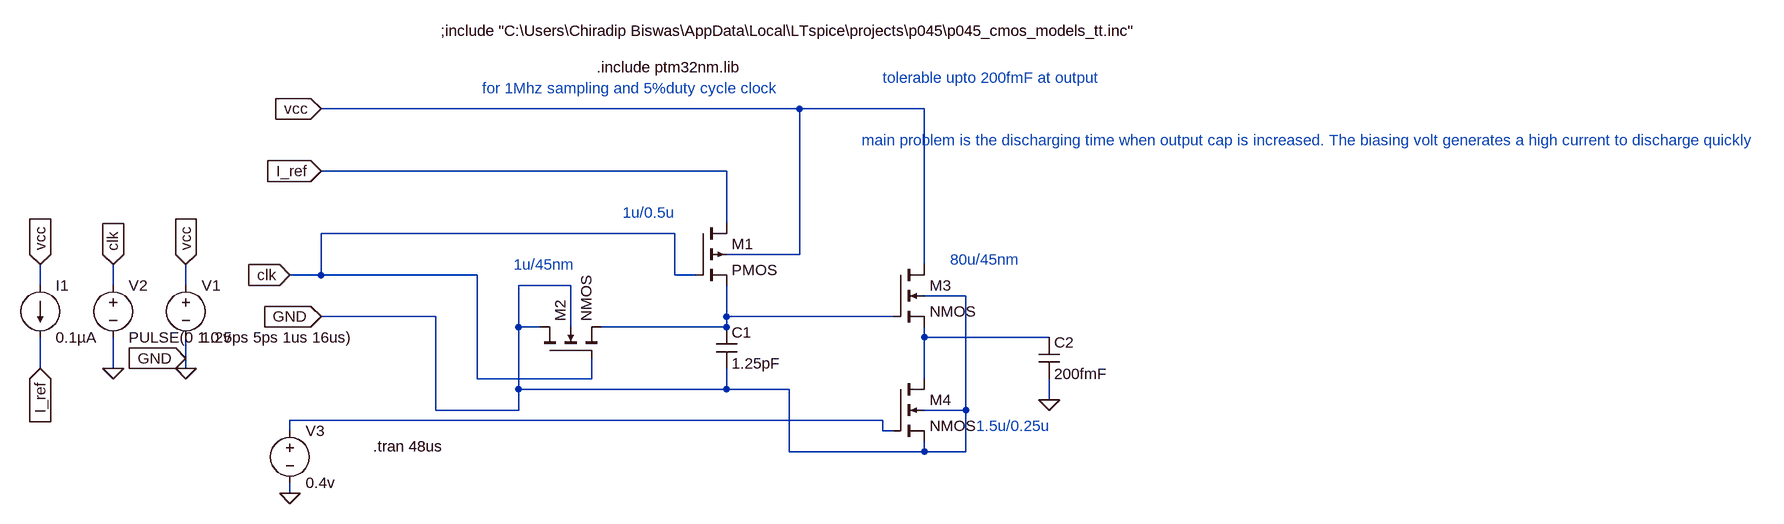
[diagram p0: schematic ramping_ckt_trials.asc]
ramping_ckt_trials.asc, the LTspice schematic file:
Version 4
SHEET 1 2788 924
WIRE 864 96 128 96
WIRE 1056 96 864 96
WIRE 752 192 128 192
WIRE 752 272 752 192
WIRE 672 288 128 288
WIRE 864 320 864 96
WIRE 864 320 752 320
WIRE 1056 336 1056 96
WIRE 128 352 128 288
WIRE 128 352 80 352
WIRE 368 352 128 352
WIRE 672 352 672 288
WIRE 704 352 672 352
WIRE -304 368 -304 336
WIRE -192 368 -192 336
WIRE -80 368 -80 336
WIRE 512 368 432 368
WIRE 1120 384 1056 384
WIRE 304 416 128 416
WIRE 752 416 752 368
WIRE 1008 416 752 416
WIRE 432 432 432 368
WIRE 464 432 432 432
WIRE 512 432 512 368
WIRE 752 432 752 416
WIRE 752 432 560 432
WIRE 1056 448 1056 432
WIRE 1248 448 1056 448
WIRE -80 480 -80 448
WIRE -304 496 -304 448
WIRE -192 496 -192 448
WIRE -80 496 -80 480
WIRE 368 512 368 352
WIRE 544 512 544 480
WIRE 544 512 368 512
WIRE 1056 512 1056 448
WIRE 432 528 432 432
WIRE 752 528 752 496
WIRE 752 528 432 528
WIRE 848 528 752 528
WIRE 1248 544 1248 512
WIRE 304 560 304 416
WIRE 432 560 432 528
WIRE 432 560 304 560
WIRE 1120 560 1120 384
WIRE 1120 560 1056 560
WIRE 992 576 80 576
WIRE 80 592 80 576
WIRE 992 592 992 576
WIRE 1008 592 992 592
WIRE 848 624 848 528
WIRE 1056 624 1056 608
WIRE 1056 624 848 624
WIRE 1120 624 1120 560
WIRE 1120 624 1056 624
WIRE 80 688 80 672
FLAG 128 192 I_ref
IOPIN 128 192 In
FLAG 80 352 clk
IOPIN 80 352 In
FLAG 128 96 vcc
IOPIN 128 96 In
FLAG 128 416 GND
IOPIN 128 416 In
FLAG -80 496 0
FLAG -192 496 0
FLAG -80 336 vcc
IOPIN -80 336 In
FLAG -192 336 clk
IOPIN -192 336 In
FLAG -304 336 vcc
IOPIN -304 336 In
FLAG -304 496 I_ref
IOPIN -304 496 In
FLAG -80 480 GND
IOPIN -80 480 In
FLAG 80 688 0
FLAG 1248 544 0
SYMBOL pmos4 704 272 R0
SYMATTR InstName M1
SYMATTR Value2 l=0.5u w=1u
SYMBOL nmos4 464 480 R270
SYMATTR InstName M2
SYMATTR Value2 l=45nm w=1u
SYMBOL cap 736 432 R0
SYMATTR InstName C1
SYMATTR Value 1.25pF
SYMBOL voltage -80 352 R0
WINDOW 123 0 0 Left 0
WINDOW 39 0 0 Left 0
SYMATTR InstName V1
SYMATTR Value 1.2v
SYMBOL voltage -192 352 R0
WINDOW 123 0 0 Left 0
WINDOW 39 0 0 Left 0
SYMATTR InstName V2
SYMATTR Value PULSE(0 1 0 5ps 5ps 1us 16us)
SYMBOL current -304 368 R0
WINDOW 123 0 0 Left 0
WINDOW 39 0 0 Left 0
SYMATTR InstName I1
SYMATTR Value 0.1µA
SYMBOL voltage 80 576 R0
WINDOW 123 0 0 Left 0
WINDOW 39 0 0 Left 0
SYMATTR InstName V3
SYMATTR Value 0.4v
SYMBOL nmos4 1008 336 R0
SYMATTR InstName M3
SYMATTR Value2 l=45nm w=80u
SYMBOL nmos4 1008 512 R0
SYMATTR InstName M4
SYMATTR Value2 l=0.25u w=1.5u
SYMBOL cap 1232 448 R0
SYMATTR InstName C2
SYMATTR Value 200fmF
TEXT 552 32 Left 2 !.include ptm32nm.lib
TEXT 592 256 Left 2 ;1u/0.5u
TEXT 424 336 Left 2 ;1u/45nm
TEXT 208 616 Left 2 !.tran 48us
TEXT 312 -24 Left 2 !;include "C:\\Users\\Chiradip Biswas\\AppData\\Local\\LTspice\\projects\\p045\\p045_cmos_models_tt.inc"
TEXT 1096 328 Left 2 ;80u/45nm
TEXT 1136 584 Left 2 ;1.5u/0.25u
TEXT 376 64 Left 2 ;for 1Mhz sampling and 5%duty cycle clock
TEXT 992 48 Left 2 ;tolerable upto 200fmF at output
TEXT 960 144 Left 2 ;main problem is the discharging time when output cap is increased. The biasing volt generates a high current to discharge quickly

The netlist it stands for:
* ramping_ckt_trials.asc
M1 I_ref clk N001 vcc PMOS l=0.5u w=1u
M2 0 clk N001 0 NMOS l=45nm w=1u
C1 N001 0 1.25pF
V1 vcc 0 1.2v
V2 clk 0 PULSE(0 1 0 5ps 5ps 1us 16us)
I1 vcc I_ref 0.1µA
V3 N003 0 0.4v
M3 vcc N001 N002 0 NMOS l=45nm w=80u
M4 N002 N003 0 0 NMOS l=0.25u w=1.5u
C2 N002 0 200fmF
.model NMOS NMOS
.model PMOS PMOS
.lib standard.mos
.include ptm32nm.lib
* 1u/0.5u
* 1u/45nm
.tran 48us
;include "C:\Users\Chiradip Biswas\AppData\Local\LTspice\projects\p045\p045_cmos_models_tt.inc"
* 80u/45nm
* 1.5u/0.25u
* for 1Mhz sampling and 5%duty cycle clock
* tolerable upto 200fmF at output
* main problem is the discharging time when output cap is increased. The biasing volt generates a high current to discharge quickly
.backanno
.end